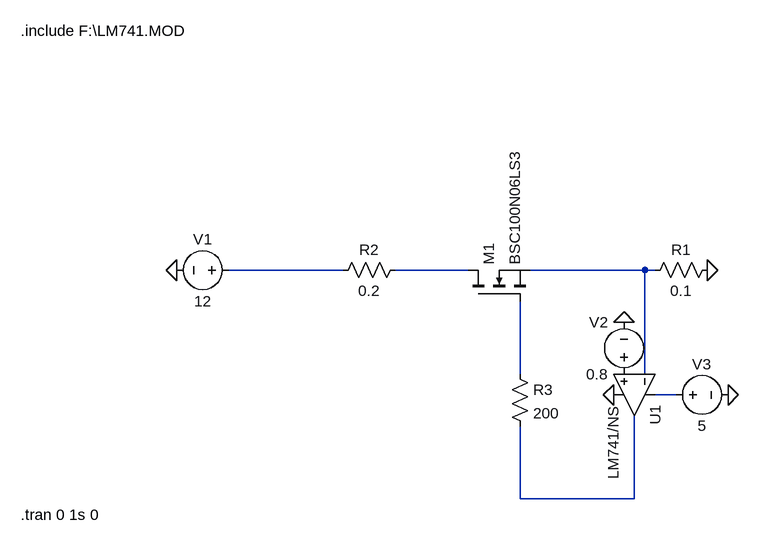
[diagram p0: schematic R- OP AMP CURRENT CONTROL DC.asc]
R- OP AMP CURRENT CONTROL DC.asc, the LTspice schematic file:
Version 4
SHEET 1 1348 680
WIRE 400 112 224 112
WIRE 592 112 480 112
WIRE 864 112 688 112
WIRE 880 112 864 112
WIRE 672 272 672 160
WIRE 864 272 864 112
WIRE 912 304 880 304
WIRE 672 464 672 352
WIRE 848 464 848 336
WIRE 848 464 672 464
FLAG 960 112 0
FLAG 144 112 0
FLAG 992 304 0
FLAG 816 304 0
FLAG 832 192 0
SYMBOL OpAmps\\opamp2 912 304 R90
SYMATTR InstName U1
SYMATTR Value LM741/NS
SYMBOL nmos 592 160 R270
SYMATTR InstName M1
SYMATTR Value BSC100N06LS3
SYMBOL res 976 96 R90
WINDOW 0 0 56 VBottom 2
WINDOW 3 32 56 VTop 2
SYMATTR InstName R1
SYMATTR Value 0.1
SYMBOL res 496 96 R90
WINDOW 0 0 56 VBottom 2
WINDOW 3 32 56 VTop 2
SYMATTR InstName R2
SYMATTR Value 0.2
SYMBOL voltage 240 112 R90
WINDOW 0 -32 56 VBottom 2
WINDOW 3 32 56 VTop 2
WINDOW 123 0 0 Left 0
WINDOW 39 0 0 Left 0
SYMATTR InstName V1
SYMATTR Value 12
SYMBOL voltage 896 304 R270
WINDOW 0 32 56 VTop 2
WINDOW 3 -32 56 VBottom 2
WINDOW 123 0 0 Left 0
WINDOW 39 0 0 Left 0
SYMATTR InstName V3
SYMATTR Value 5
SYMBOL voltage 832 288 R180
WINDOW 0 24 96 Left 2
WINDOW 3 24 16 Left 2
WINDOW 123 0 0 Left 0
WINDOW 39 0 0 Left 0
SYMATTR InstName V2
SYMATTR Value 0.8
SYMBOL res 656 256 R0
SYMATTR InstName R3
SYMATTR Value 200
TEXT -96 -256 Left 2 !.include F:\\LM741.MOD
TEXT -96 488 Left 2 !.tran 0 1s 0

The netlist it stands for:
* R- OP AMP CURRENT CONTROL DC.asc
XU1 P001 N003 N005 0 N006 LM741/NS  ; pins In+ In- V+ V- OUT
M1 N002 N004 N003 N003 BSC100N06LS3
R1 0 N003 0.1
R2 N002 N001 0.2
V1 N001 0 12
V3 N005 0 5
V2 P001 0 0.8
R3 N004 N006 200
.model NMOS NMOS
.model PMOS PMOS
.lib standard.mos
.include F:\LM741.MOD
.tran 0 1s 0
.backanno
.end